# EAGLE schematic Schematic (EAGLE 9.7.0)
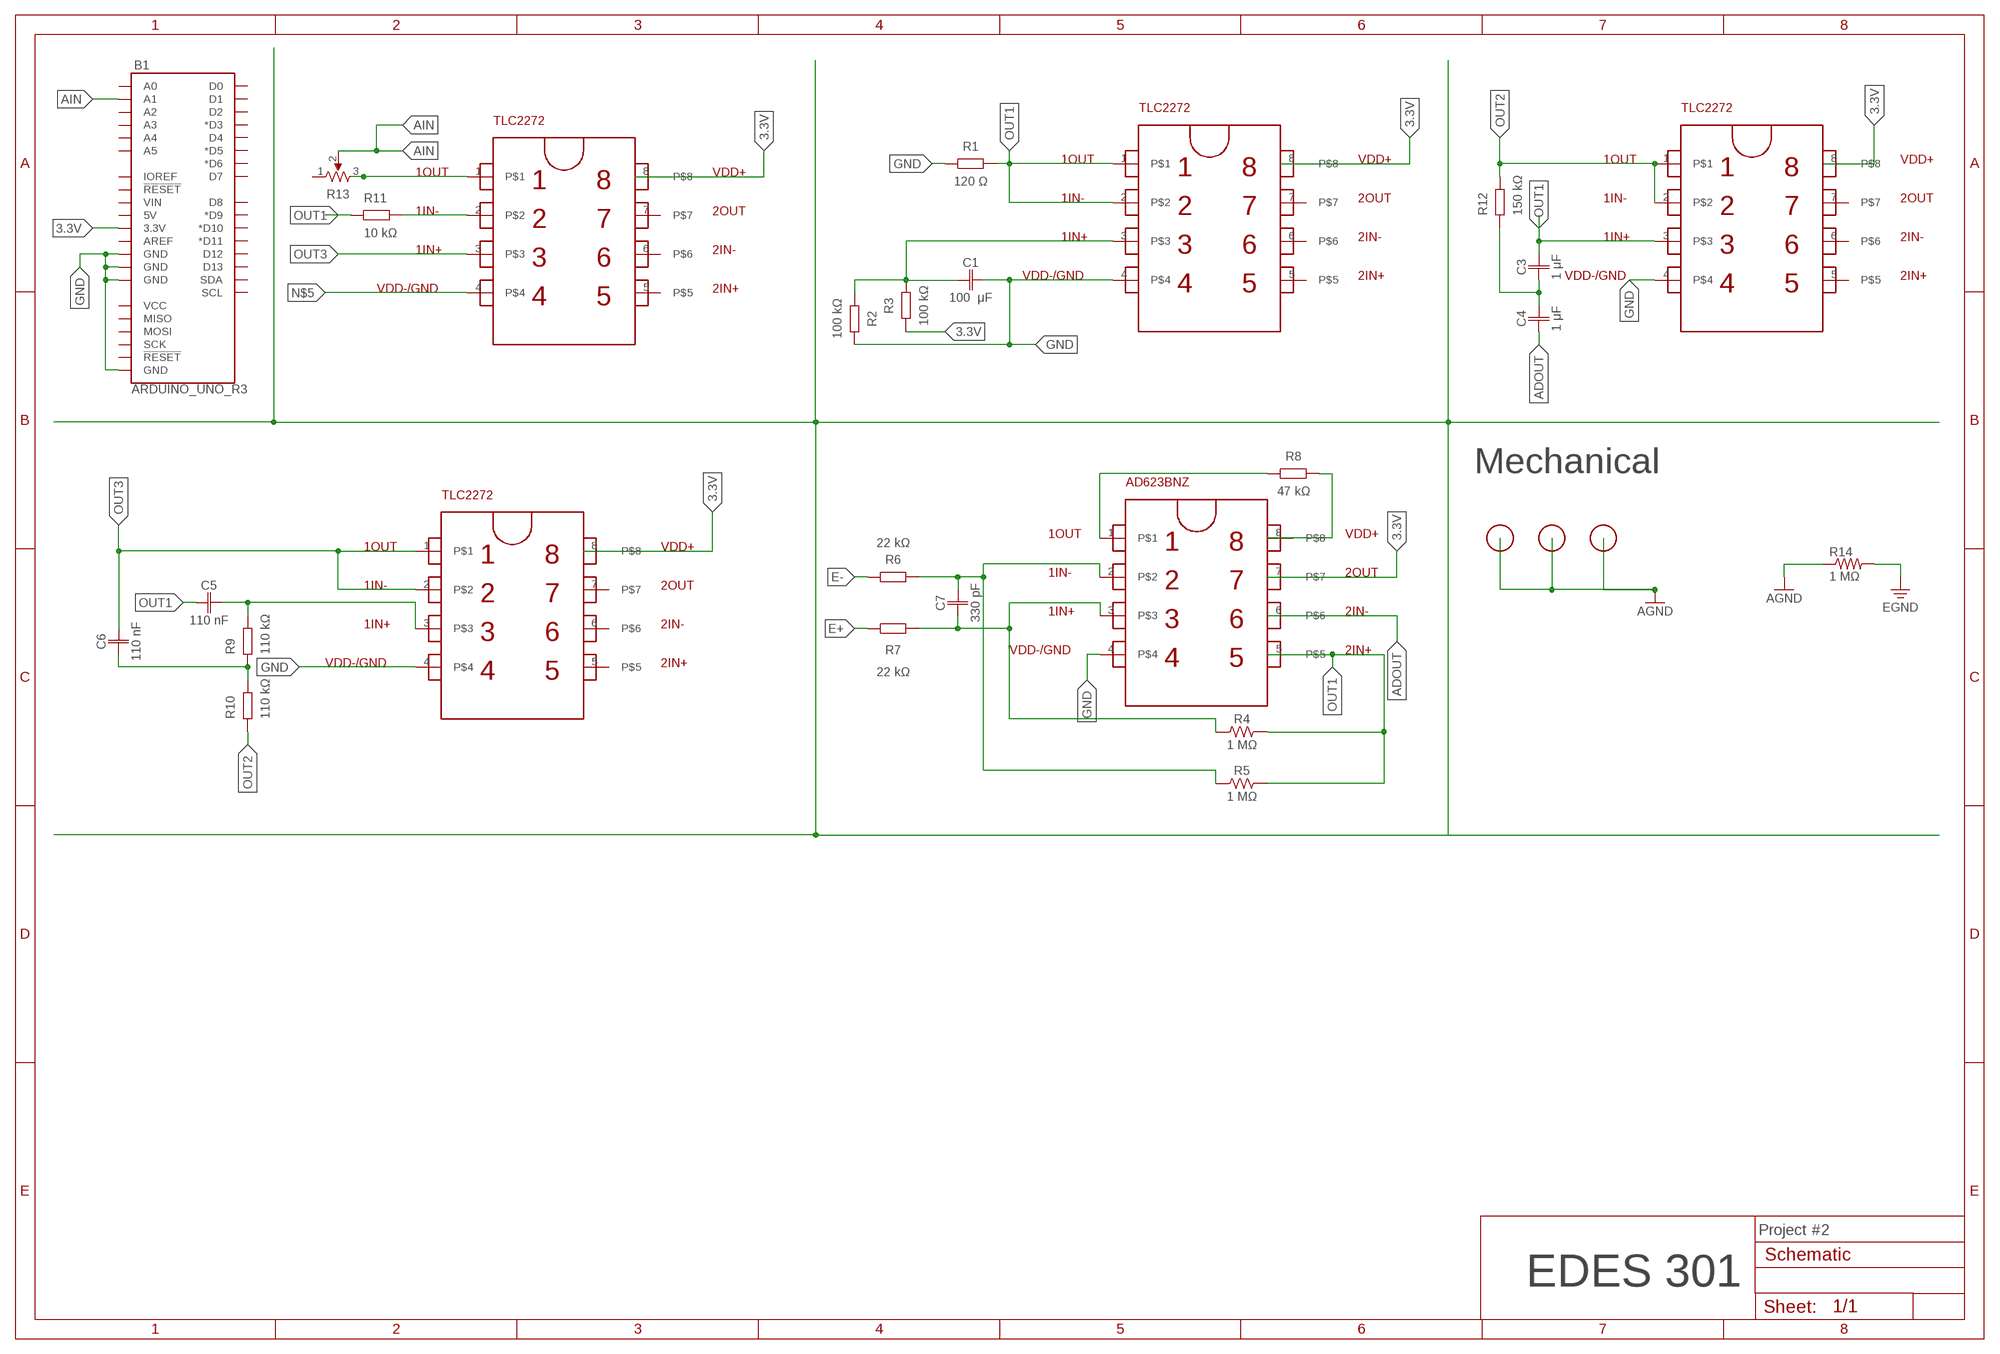
[diagram p0: schematic, sheet 1]

## Parts
B1  ARDUINO_UNO_R3  [ARDUINO_R3]
C1  100 μF  C_CHIP-0402(1005-METRIC)  [CAPC1005X60]
C3  1 μF  C_CHIP-0402(1005-METRIC)  [CAPC1005X60]
C4  1 μF  C_CHIP-0402(1005-METRIC)  [CAPC1005X60]
C5  110 nF  C_CHIP-0402(1005-METRIC)  [CAPC1005X60]
C6  110 nF  C_CHIP-0402(1005-METRIC)  [CAPC1005X60]
C7  330 pF  C_CHIP-0402(1005-METRIC)  [CAPC1005X60]
R1  120 Ω  R_CHIP-0402(1005-METRIC)  [RESC1005X40]
R2  100 kΩ  R_CHIP-0402(1005-METRIC)  [RESC1005X40]
R3  100 kΩ  R_CHIP-0402(1005-METRIC)  [RESC1005X40]
R4  1 MΩ  R-US_CHIP-0402(1005-METRIC)  [RESC1005X40]
R5  1 MΩ  R-US_CHIP-0402(1005-METRIC)  [RESC1005X40]
R6  22 kΩ  R_CHIP-0402(1005-METRIC)  [RESC1005X40]
R7  22 kΩ  R_CHIP-0402(1005-METRIC)  [RESC1005X40]
R8  47 kΩ  R_CHIP-0402(1005-METRIC)  [RESC1005X40]
R9  110 kΩ  R  (no package)
R10  110 kΩ  R  (no package)
R11  10 kΩ  R  (no package)
R12  150 kΩ  R  (no package)
R13  PTV09A-40-B20220F  [PTV09A-X]
R14  1 MΩ  R-US_CHIP-0402(1005-METRIC)  [RESC1005X40]
U$1  AD623BNZDIP8  [DIP8]
U$2  TLC2272  [DIP8]
U$3  TLC2272  [DIP8]
U$4  TLC2272  [DIP8]
U$5  TLC2272  [DIP8]
U$6  FIDUCIAL  [FIDUCIAL_1MM]
U$7  FIDUCIAL  [FIDUCIAL_1MM]
U$9  FIDUCIAL  [FIDUCIAL_1MM]

## Nets
3.3V: B1.3.3V R3.1 U$1.7 U$2.8 U$3.8 U$5.8
ADOUT: C4.1 U$1.6
AIN: B1.A1 R13.2
E+: R7.1
E-: R6.1
EGND: R14.2
GND: B1.GND@1(GND) B1.GND@2(GND) B1.GND@3(GND) B1.GND@4(GND) C1.2 R1.1 R2.2 U$1.4 U$2.4 U$3.4 U$5.4
N$1: C3.1 C4.2 R12.1
N$4: C1.1 R2.1 R3.2 U$5.3
N$5: U$4.4
N$6: R14.1 ; supply symbol labelled AGND
N$7: C5.2 R9.2 U$3.3
N$9: C7.2 R5.1 R6.2 U$1.2
N$10: C7.1 R4.1 R7.2 U$1.3
N$11: R8.2 U$1.8
N$16: R8.1 U$1.1
N$22: C6.1 R9.1 R10.2
N$26: U$4.8
N$28: R11.2 U$4.2
N$30: R13.3 U$4.1
OUT1: C3.2 C5.1 R1.2 R4.2 R5.2 R11.1 U$1.5 U$2.3 U$5.1 U$5.2
OUT2: R10.1 R12.2 U$2.1 U$2.2
OUT3: C6.2 U$3.1 U$3.2 U$4.3
Unconnected: B1.5V B1.A0 B1.A2 B1.A3 B1.A4 B1.A5 B1.AREF B1.D0 B1.D1 B1.D2 B1.D3(*D3) B1.D4 B1.D5(*D5) B1.D6(*D6) B1.D7 B1.D8 B1.D9(*D9) B1.D10(*D10) B1.D11(*D11) B1.D12 B1.D13 B1.IOREF B1.MISO B1.MOSI B1.RESET@1(!RESET!) B1.RESET@2(!RESET!) B1.SCK B1.SCL B1.SDA B1.VCC B1.VIN R13.1 U$2.5 U$2.6 U$2.7 U$3.5 U$3.6 U$3.7 U$4.5 U$4.6 U$4.7 U$5.5 U$5.6 U$5.7

## Notes on the sheet
- Mechanical
- Project #2
- EDES 301

## Library data of the parts
B1 = Library:ARDUINO_UNO_R3: Arduino R3 Footprint with SPI header Arduino Uno R3 Compatible Footprint. Matches PCB size of the original board. SparkFun Products: SAMD21 Dev Breakout <https://www.sparkfun.com/products/13672> RedBoard <https://www.sparkfun.com/products/12757> R3 Stackable Headers <https://www.sparkfun.com/products/11417>; MANUFACTURER: SparkFun Electronics
C1 C3-C7 = Capacitor:C: Capacitor - Generic; CATEGORY: Capacitor; MANUFACTURER: Bourns Inc.; PACKAGE_SIZE: 0402; PACKAGE_TYPE: Surface Mount; SUBCATEGORY: Ceramic Capacitors; TYPE: MLCC
R1-R3 R6-R8 = Resistor:R: Resistor Fixed - Generic; CATEGORY: Resistors; DESCRIPTION: Chip Resistor 1.05 X 0.54 X 0.40 mm body 0402(1005-METRIC) Package; MANUFACTURER: Bourns Inc.; PACKAGE_SIZE: 0402; PACKAGE_TYPE: Surface Mount
R4 R5 = Resistor:R-US: Resistor Fixed - ANSI; CATEGORY: Resistors; DESCRIPTION: Chip Resistor 1.05 X 0.54 X 0.40 mm body 0402(1005-METRIC) Package; MANUFACTURER: Bourns Inc.; PACKAGE_SIZE: 0402; PACKAGE_TYPE: Surface Mount
R9-R12 = Ngspice-Simulation:R: RESISTOR
R13 = Resistor:PTV09A-40?: Potentiometer 2K Ohm 1/20W Carbon Linear; CATEGORY: Potentiometers; DATASHEET: https://www.bourns.com/docs/Product-Datasheets/PTV09.pdf; DESCRIPTION: 2k Ohm 1 Gang Linear Through Hole Snap In Potentiometer 1.0 Turns Carbon 0.05W 1/20W PC Pins Board Locks; MANUFACTURER: Bourns Inc.; MPN: PTV09A-4020F-B202; OPERATING_TEMPERATURE: -10°C ~ 50°C; PACKAGE_SIZE: NA; PACKAGE_TYPE: Through Hole; PART_STATUS: Active; ROHS: Compliant; SERIES: Pro Audio PTV09; SUBCATEGORY: Variable Resistors; TEMPERATURE_COEFFICIENT: NA; THERMALLOSS: 0.05 W; TOLERANCE: ±20%; TYPE: Rotary Potentiometers
R14 = Tutorial - Fusion 360:R-US: Resistor Fixed - ANSI; CATEGORY: Resistor; MANUFACTURER: Bourns Inc.; SUB-CATEGORY: Fixed
U$1 = Library:AD623BNZ; MANUFACTURER: DigiKey
U$2-U$5 = Library:TLC2272; MANUFACTURER: DigiKey
U$6 U$7 U$9 = adafruit:FIDUCIAL: For use by pick and place machines to calibrate the vision/machine, 1mm By microbuilder.eu